# Altium project Liq_Power.PrjPcb
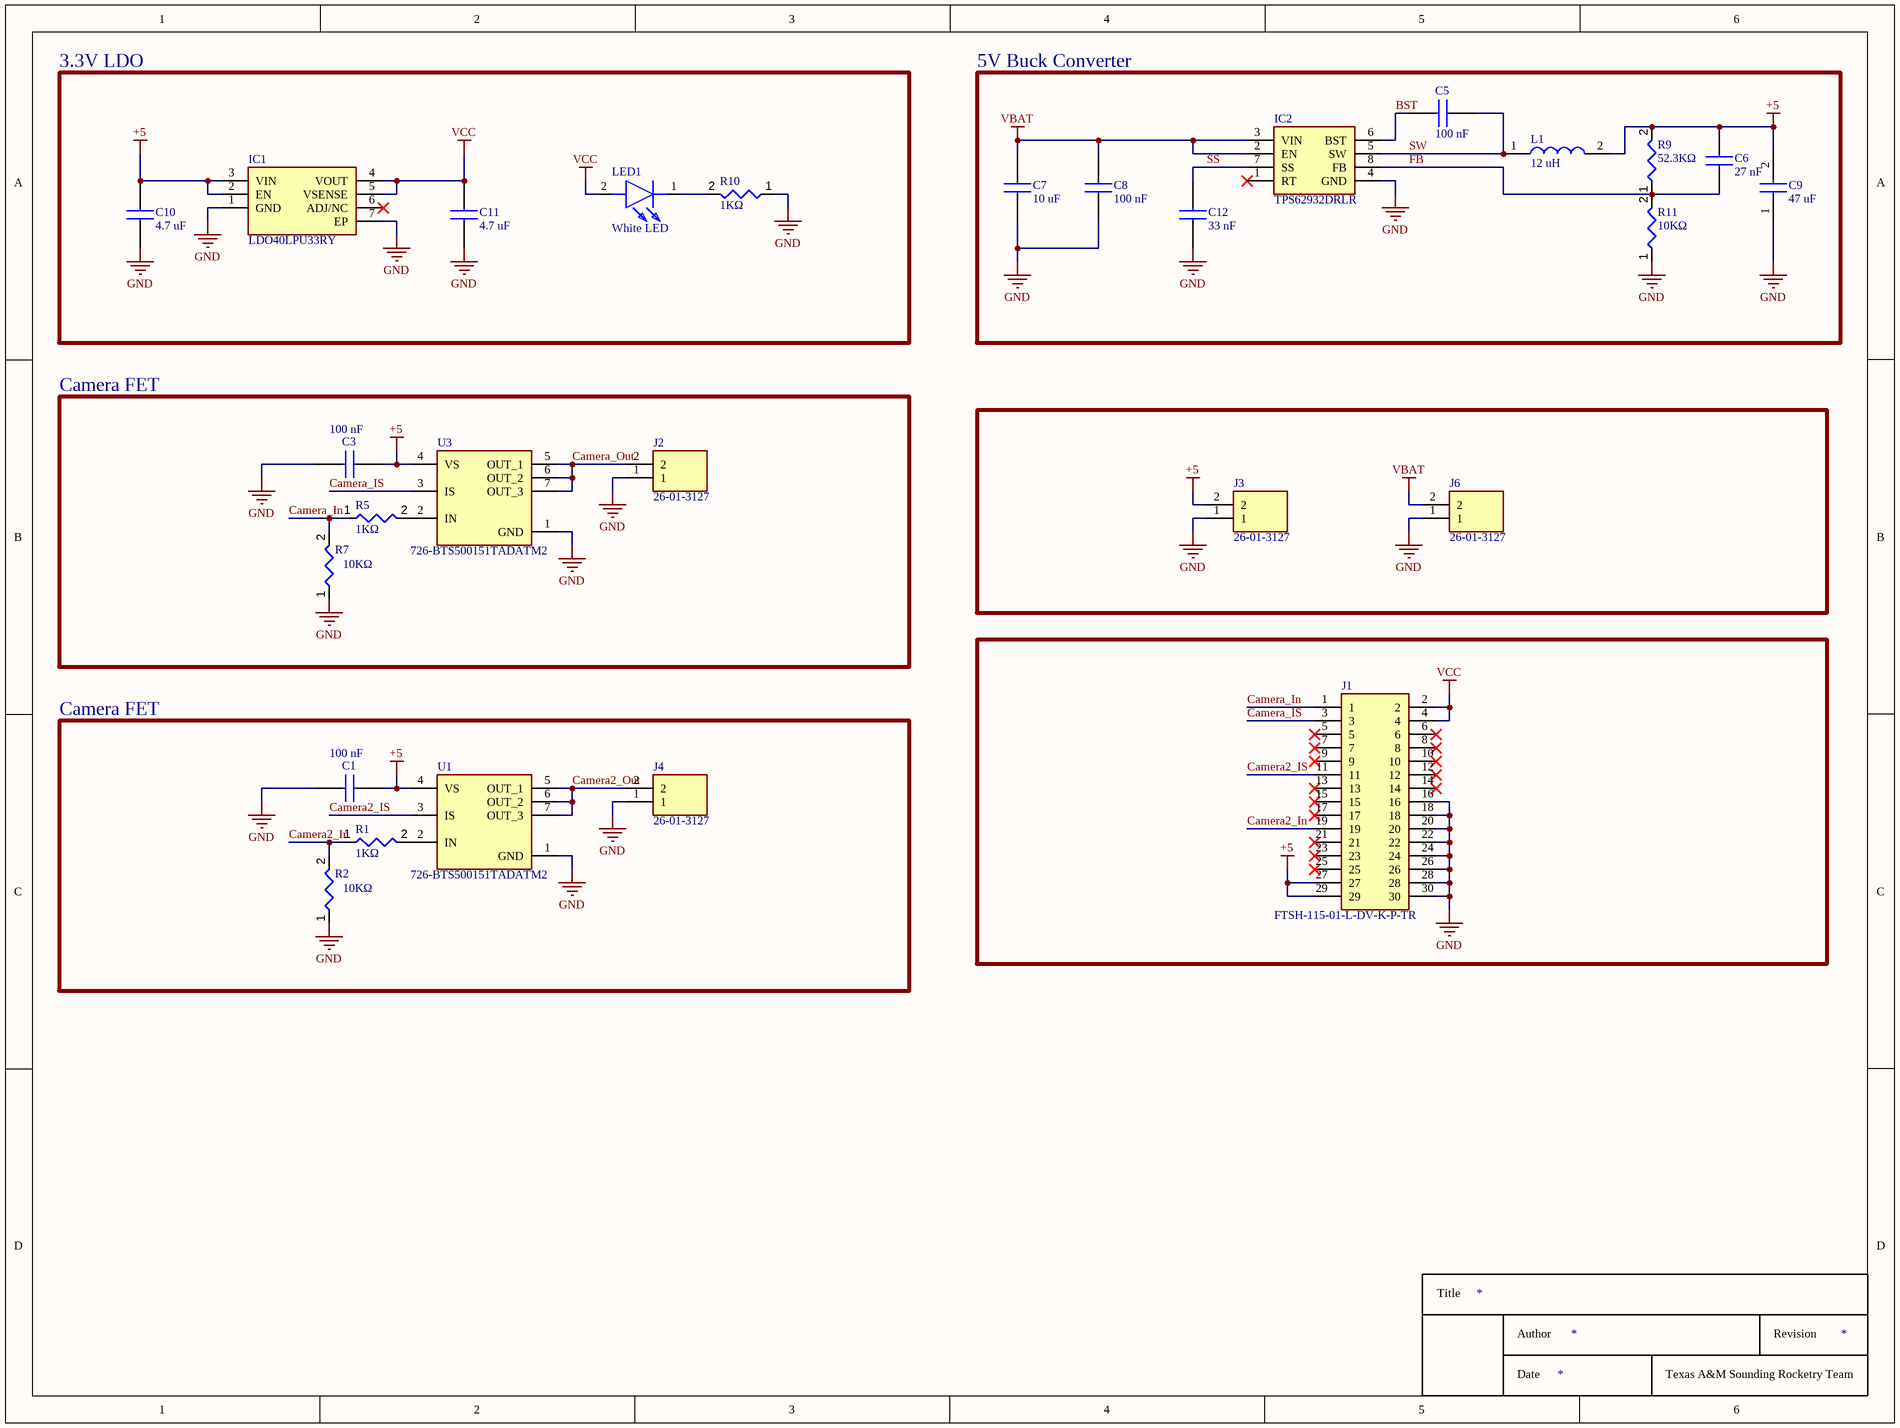
[diagram p0: Liq_Power.SchDoc]
1 sheet, 28 parts. Net scope: global (net labels, ports and power ports of the same name join across sheets).
Board file: Liq_Power.PcbDoc

## Sheet Liq_Power.SchDoc
size 355 x 266 mm; SheetNumber: 1; SheetTotal: 1

### Parts
C1  100 nF  [CAP_0603]
C3  100 nF  [CAP_0603]
C5  100 nF  [CAP_0603]
C6  27 nF  [CAP_0603]
C7  10 uF  [CAP_0603]
C8  100 nF  [CAP_0603]
C9  47 uF  [CAPC2012X145N]
C10  4.7 uF  [CAP_0603]
C11  4.7 uF  [CAP_0603]
C12  33 nF  [CAP_0603]
IC1  LDO40LPU33RY  [SON95P300X300X90-7N-D]
IC2  TPS62932DRLR  [TPS62932DRLR]
J1  FTSH-115-01-L-DV-K-P-TR  [FTSH-115-XX-YYY-DV-K-P-TR]
J2  26-01-3127  [26013127]
J3  26-01-3127  [26013127]
J4  26-01-3127  [26013127]
J6  26-01-3127  [26013127]
L1  12 uH  [INDPM127127X850N]
LED1  White LED  [LEDC2012X90N]
R1  1KΩ  [RES_0603]
R2  10KΩ  [RES_0603]
R5  1KΩ  [RES_0603]
R7  10KΩ  [RES_0603]
R9  52.3KΩ  [RES_0603]
R10  1KΩ  [RES_0603]
R11  10KΩ  [RES_0603]
U1  726-BTS500151TADATM2  [BTS500151TADATMA2]
U3  726-BTS500151TADATM2  [BTS500151TADATMA2]

### Blocks framed on the sheet
3.3V LDO: C10 C11 IC1 LED1 R10
5V Buck Converter: C5-C9 C12 IC2 L1 R9 R11
Camera FET: C3 J2 R5 R7 U3
Camera FET: C1 J4 R1 R2 U1

### Nets
+5: C1.1 C3.1 C6.2 C9.2 C10.2 IC1.2(EN) IC1.3(VIN) J1.27 J1.29 J3.2 L1.2 R9.2 U1.4(VS) U3.4(VS)
GND: C1.2 C3.2 C7.1 C8.1 C9.1 C10.1 C11.1 C12.1 IC1.1(GND) IC1.7(EP) IC2.4(GND) J1.16 J1.18 J1.20 J1.22 J1.24 J1.26 J1.28 J1.30 J2.1 J3.1 J4.1 J6.1 R2.1 R7.1 R10.1 R11.1 U1.1(GND) U3.1(GND)
VBAT: C7.2 C8.2 IC2.2(EN) IC2.3(VIN) J6.2
VCC: C11.2 IC1.4(VOUT) IC1.5(VSENSE) J1.2 J1.4 LED1.2(A)
BST: C5.1 IC2.6(BST)
Camera2_In: J1.19 R1.1 R2.2
Camera2_IS: J1.11 U1.3(IS)
Camera2_Out: J4.2 U1.5(OUT_1) U1.6(OUT_2) U1.7(OUT_3)
Camera_In: J1.1 R5.1 R7.2
Camera_IS: J1.3 U3.3(IS)
Camera_Out: J2.2 U3.5(OUT_1) U3.6(OUT_2) U3.7(OUT_3)
FB: C6.1 IC2.8(FB) R9.1 R11.2
SS: C12.2 IC2.7(SS)
SW: C5.2 IC2.5(SW) L1.1
NetLED1_1: LED1.1(K) R10.2
NetR1_2: R1.2 U1.2(IN)
NetR5_2: R5.2 U3.2(IN)

Not connected (* = marked no-connect by the designer): IC1 6(ADJ/NC)*; IC2 1(RT)*; J1 5* 6* 7* 8* 9* 10* 12* 13* 14* 15* 17* 21* 23* 25*

### Notes on the sheet
- Title
- Author
- Date
- Texas A&M Sounding Rocketry Team
- Revision

### Library data of the parts
C1 C3 C5 C8 = 100 nF Capacitor, 0603: Multilayer Ceramic Capacitors MLCC - SMD/SMT KGM15BR71H104JT NEW GLOBAL PN 50V 0.1uF A 581-KGM15BR71H104JT; Manufacturer 1: KYOCERA AVX; Manufacturer Part Number 1: 06035C104JAT2A; Tolerance: 5%; Value: 100 nF; Voltage: 50 V; Package: 0603; Library Ref: Capacitor_BASE; Design Item ID: 100 nF Capacitor, 0603; Supplier 1: Mouser; Supplier Part Number 1: 581-06035C104JAT2A
C6 = 27 nF Capacitor, 0603: Multilayer Ceramic Capacitors MLCC - SMD/SMT KGM15BR71H273JT NEW GLOBAL PN 50V 0.027u A 581-KGM15BR71H273JT; Manufacturer 1: KYOCERA AVX; Manufacturer Part Number 1: 06035C273JAT2A; MPN: 581-06035C273JAT2A; Tolerance: 5%; Value: 27 nF; Voltage: 50 V; Package: 0603; Library Ref: Capacitor_BASE; Design Item ID: 27 nF Capacitor, 0603; Supplier 1: Mouser
C7 = 10 uF Capacitor, 0603: Multilayer Ceramic Capacitors MLCC - SMD/SMT KGM15BR71H224JT NEW GLOBAL PN 50V 0.22uF A 581-KGM15BR71H224JT; Manufacturer 1: KYOCERA AVX; Manufacturer Part Number 1: 06033D106KAT2A; Tolerance: 10%; Voltage: 25 V; Value: 10 uF; Package: 0603; Library Ref: Capacitor_BASE; Design Item ID: 10 uF Capacitor, 0603; Supplier 1: Mouser; Supplier Part Number 1: 581-06033D106KAT2A
C9 = 47 uF: KGM21AR51A476MU / 20% 10V; Manufacturer_Name: Kyocera AVX; Datasheet Link: https://www.mouser.it/datasheet/2/40/cx5r_KGM-3223198.pdf; Height: 1.45mm; Manufacturer_Part_Number: KGM21AR51A476MU; Mouser Part Number: 581-KGM21AR51A476MU; Mouser Price/Stock: https://www.mouser.co.uk/ProductDetail/KYOCERA-AVX/KGM21AR51A476MU?qs=Jm2GQyTW%2Fbh2M%2FAPQlqugw%3D%3D
C10 C11 = 4.7 uF Capacitor, 0603: Multilayer Ceramic Capacitors MLCC - SMD/SMT KGM15BR71H224JT NEW GLOBAL PN 50V 0.22uF A 581-KGM15BR71H224JT; Manufacturer 1: KYOCERA AVX; Manufacturer Part Number 1: 06033D475KAT2A; MPN: 581-06033D475KAT2A; Tolerance: 10%; Voltage: 25 V; Value: 4.7 uF; Package: 0603; Library Ref: Capacitor_BASE; Design Item ID: 4.7 uF Capacitor, 0603; Supplier 1: Mouser
C12 = 33 nF Capacitor, 0603: Multilayer Ceramic Capacitors MLCC - SMD/SMT KGM15BR71H333JM NEW GLOBAL PN 50V .033uF A 581-KGM15BR71H333JM; Manufacturer 1: KYOCERA AVX; Manufacturer Part Number 1: 06035C333JAT4A; Tolerance: 5%; Value: 33 nF; Voltage: 50 V; Package: 0603; Library Ref: Capacitor_BASE; Design Item ID: 33 nF Capacitor, 0603; Supplier 1: Mouser; Supplier Part Number 1: 581-06035C333JAT4A
IC1 = LDO40LPU33RY: 3.3V 400 mA LDO; Manufacturer_Name: STMicroelectronics; Datasheet Link: https://www.st.com/resource/en/datasheet/ldo40l.pdf; Height: 0.9mm; Manufacturer_Part_Number: LDO40LPU33RY; Mouser Part Number: 511-LDO40LPU33RY; Mouser Price/Stock: https://www.mouser.co.uk/ProductDetail/STMicroelectronics/LDO40LPU33RY?qs=qSfuJ%252Bfl%2Fd5qazWclm%2Ffpg%3D%3D; Arrow Part Number: LDO40LPU33RY; Arrow Price/Stock: https://www.arrow.com/en/products/ldo40lpu33ry/stmicroelectronics?utm_currency=USD&region=europe; Supplier 1: Mouser; Supplier Part Number 1: 511-LDO40LPU33RY; Supplier 2: DigiKey; Supplier Part Number 2: 497-18288-1-ND
IC2 = TPS62932DRLR: Integrated Circuit; Manufacturer_Name: Texas Instruments; Datasheet Link: https://www.ti.com/lit/gpn/tps62932; Height: 0.6mm; Manufacturer_Part_Number: TPS62932DRLR; Mouser Part Number: 595-TPS62932DRLR; Mouser Price/Stock: https://www.mouser.co.uk/ProductDetail/Texas-Instruments/TPS62932DRLR?qs=MyNHzdoqoQL6EE0yynPHsw%3D%3D; Arrow Part Number: TPS62932DRLR; Arrow Price/Stock: https://www.arrow.com/en/products/tps62932drlr/texas-instruments?utm_currency=USD&region=nac
J1 = FTSH-115-01-L-DV-K-P-TR: 2x15 Board to Board; Manufacturer_Name: SAMTEC; Datasheet Link: http://suddendocs.samtec.com/prints/ftsh-1xx-xx-xxx-dv-xxx-xxx-mkt.pdf; Manufacturer_Part_Number: FTSH-115-01-L-DV-K-P-TR; Mouser Part Number: 200-FTSH11501LDVKPTR; Mouser Price/Stock: https://www.mouser.co.uk/ProductDetail/Samtec/FTSH-115-01-L-DV-K-P-TR?qs=%252BZP6%2F%252BtExtA4afaEWbpOPw%3D%3D; Arrow Part Number: FTSH-115-01-L-DV-K-P-TR; Arrow Price/Stock: https://www.arrow.com/en/products/ftsh-115-01-l-dv-k-p-tr/samtec
J2-J4 J6 = 26-01-3127: Connector; Manufacturer_Name: Molex; Datasheet Link: https://www.molex.com/pdm_docs/sd/026013108_sd.pdf; Height: 10mm; Manufacturer_Part_Number: 26-01-3127; Mouser Part Number: 538-26-01-3127; Mouser Price/Stock: https://www.mouser.co.uk/ProductDetail/Molex/26-01-3127?qs=ZhwKFWhxrSFuwrwfqZt8Sg%3D%3D
L1 = 12 uH: SRR1208-120ML / 25 mOhm 20%; Manufacturer_Name: Bourns; Datasheet Link: https://componentsearchengine.com/Datasheets/2/SRR1208-120ML.pdf; Height: 8.5mm; Manufacturer_Part_Number: SRR1208-120ML; Mouser Part Number: 652-SRR1208-120ML; Mouser Price/Stock: https://www.mouser.co.uk/ProductDetail/Bourns/SRR1208-120ML?qs=EMXTcfAPUUWkaFmzdAAv1A%3D%3D; Arrow Part Number: SRR1208-120ML; Arrow Price/Stock: https://www.arrow.com/en/products/srr1208-120ml/bourns?utm_currency=USD&region=nac
LED1 = White LED: LED; Manufacturer_Name: Avago Technologies; Manufacturer_Part_Number: HSMW-C170-U0000; MPN: 630-HSMW-C170-U0000; Datasheet Link: https://componentsearchengine.com/Datasheets/2/HSMW-C170-U0000.pdf; Height: 0.9mm; Mouser Price/Stock: https://www.mouser.co.uk/ProductDetail/Broadcom-Avago/HSMW-C170-U0000?qs=tMOYG%252Bw4%252BLwGyeHODzQdug%3D%3D; Supplier 1: Mouser; Supplier Part Number 1: 630-HSMW-C170-U0000
R1 R5 = 1 KOhm Resistor: Thick Film Resistors - SMD General Purpose Chip Resistor 0603, 1kOhms, 1%, 1/10W; Manufacturer 1: YAGEO; Manufacturer Part Number 1: RC0603FR-071KL; Tolerance: 0.01; Power: 0.1W; Value: 1KΩ; Package: 0603; Library Ref: Resistor_BASE; Design Item ID: 1 KOhm Resistor; Supplier 1: Mouser; Supplier Part Number 1: 603-RC0603FR-071KL
R2 R7 R11 = 10 KOhm Resistor: Thick Film Resistors - SMD General Purpose Chip Resistor 0603, 10kOhms, 1%, 1/10W; Manufacturer 1: YAGEO; Manufacturer Part Number 1: RC0603FR-0710KL; Tolerance: 0.01; Power: 0.1W; Value: 10KΩ; Package: 0603; Library Ref: Resistor_BASE; Design Item ID: 10 KOhm Resistor; Supplier 1: Mouser; Supplier Part Number 1: 603-RC0603FR-0710KL
R9 = 52.3 KOhm Resistor: Thick Film Resistors - SMD General Purpose Chip Resistor 0603, 52.3kOhms, 1%, 1/10W; Manufacturer 1: YAGEO; Manufacturer Part Number 1: RC0603FR-0752K3L; MPN: 603-RC0603FR-0752K3L; Tolerance: 0.01; Power: 0.1W; Value: 52.3KΩ; Package: 0603; Library Ref: Resistor_BASE; Design Item ID: 52.3 KOhm Resistor; Supplier 1: Mouser
R10 = 1 KOhm Resistor: Thick Film Resistors - SMD General Purpose Chip Resistor 0603, 1kOhms, 1%, 1/10W; Manufacturer 1: YAGEO; Manufacturer Part Number 1: RC0603FR-071KL; MPN: 603-RC0603FR-071KL; Tolerance: 0.01; Power: 0.1W; Value: 1KΩ; Package: 0603; Library Ref: Resistor_BASE; Design Item ID: 1 KOhm Resistor; Supplier 1: Mouser
U1 U3 = BTS500151TADATMA2: High-Side Switch 33 A; Manufacturer: Infineon Technologies; Datasheet: https://www.mouser.com/datasheet/3/70/1/Infineon_BTS50015_1TAD_DS_v01_02_EN.pdf; Manufacturer Part Number: BTS500151TADATMA2; Supplier 1: Mouser; Supplier Part Number 1: 726-BTS500151TADATM2